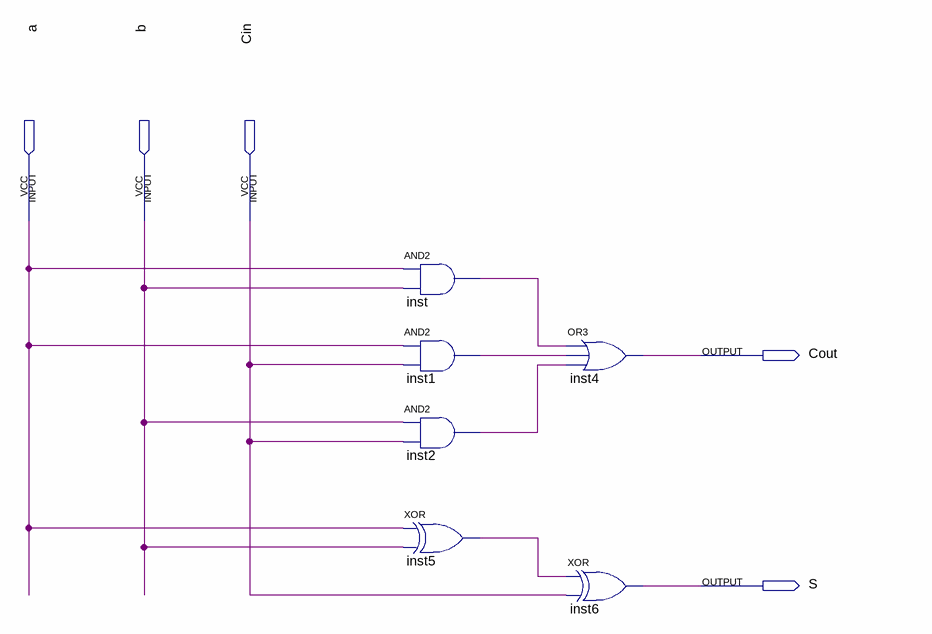
[diagram p0: schematic sheet]
// Quartus schematic FullAdder.bdf as structural Verilog: 6 symbols, 5 pins
module FullAdder (
  input  a,
  input  b,
  input  Cin,
  output Cout,
  output S
);

  wire inst1_out, inst2_out, inst5_out, inst_out;

  and inst (inst_out, a, b);
  and inst1 (inst1_out, a, Cin);
  and inst2 (inst2_out, b, Cin);
  xor inst5 (inst5_out, a, b);
  or inst4 (Cout, inst_out, inst1_out, inst2_out);
  xor inst6 (S, inst5_out, Cin);
endmodule
